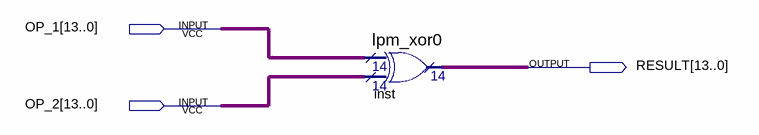
[diagram p0: schematic sheet]
// Quartus schematic OP_XOR.bdf as structural Verilog: 1 symbols, 3 pins
module OP_XOR (
  input  [13:0] OP_1,
  input  [13:0] OP_2,
  output [13:0] RESULT
);

  lpm_xor0 inst (.data0x(OP_1), .data1x(OP_2), .result(RESULT));
endmodule
